# EAGLE schematic main (EAGLE 6.5.0)
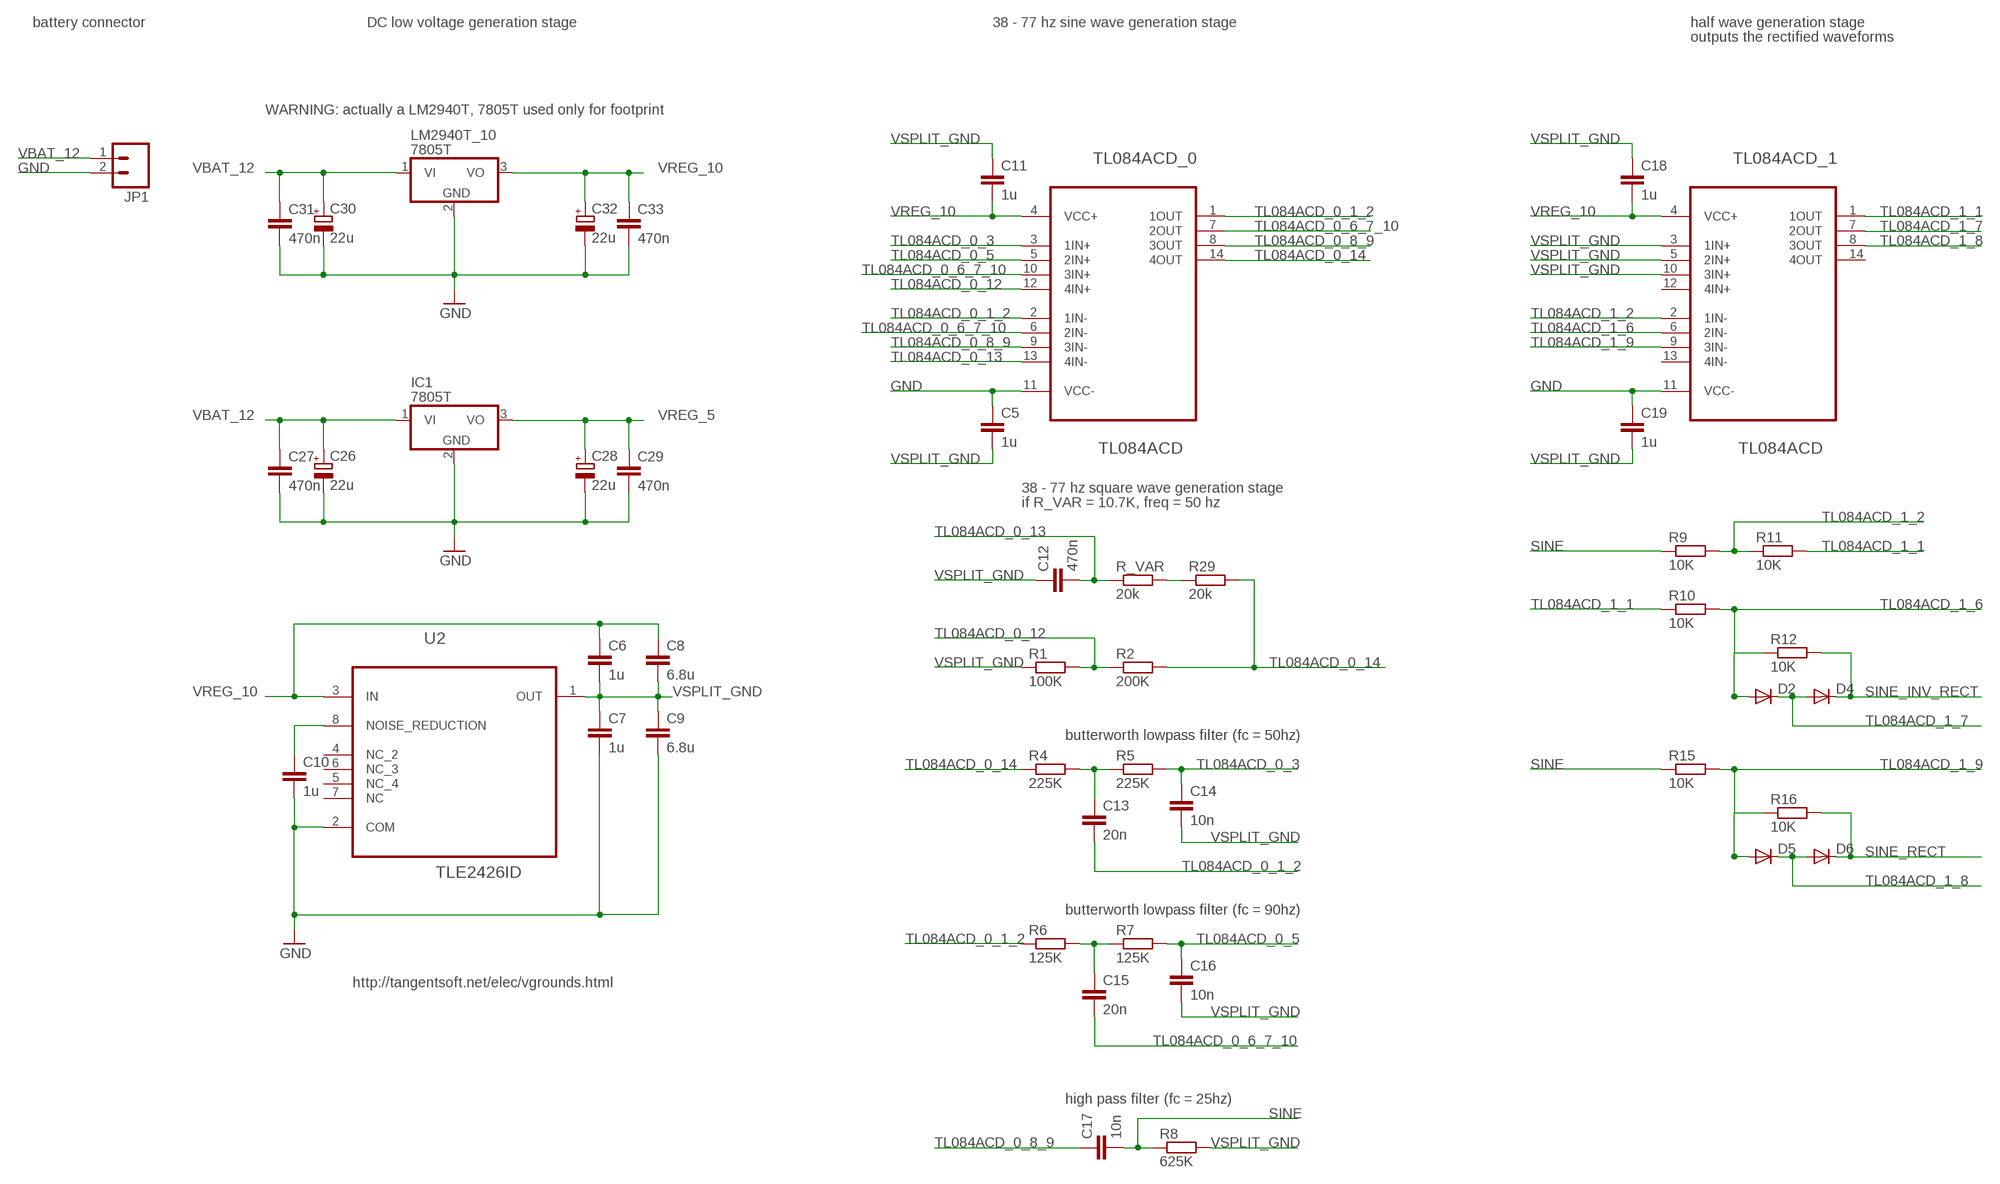
[diagram p0: schematic, sheet 1, part 1 of 2]
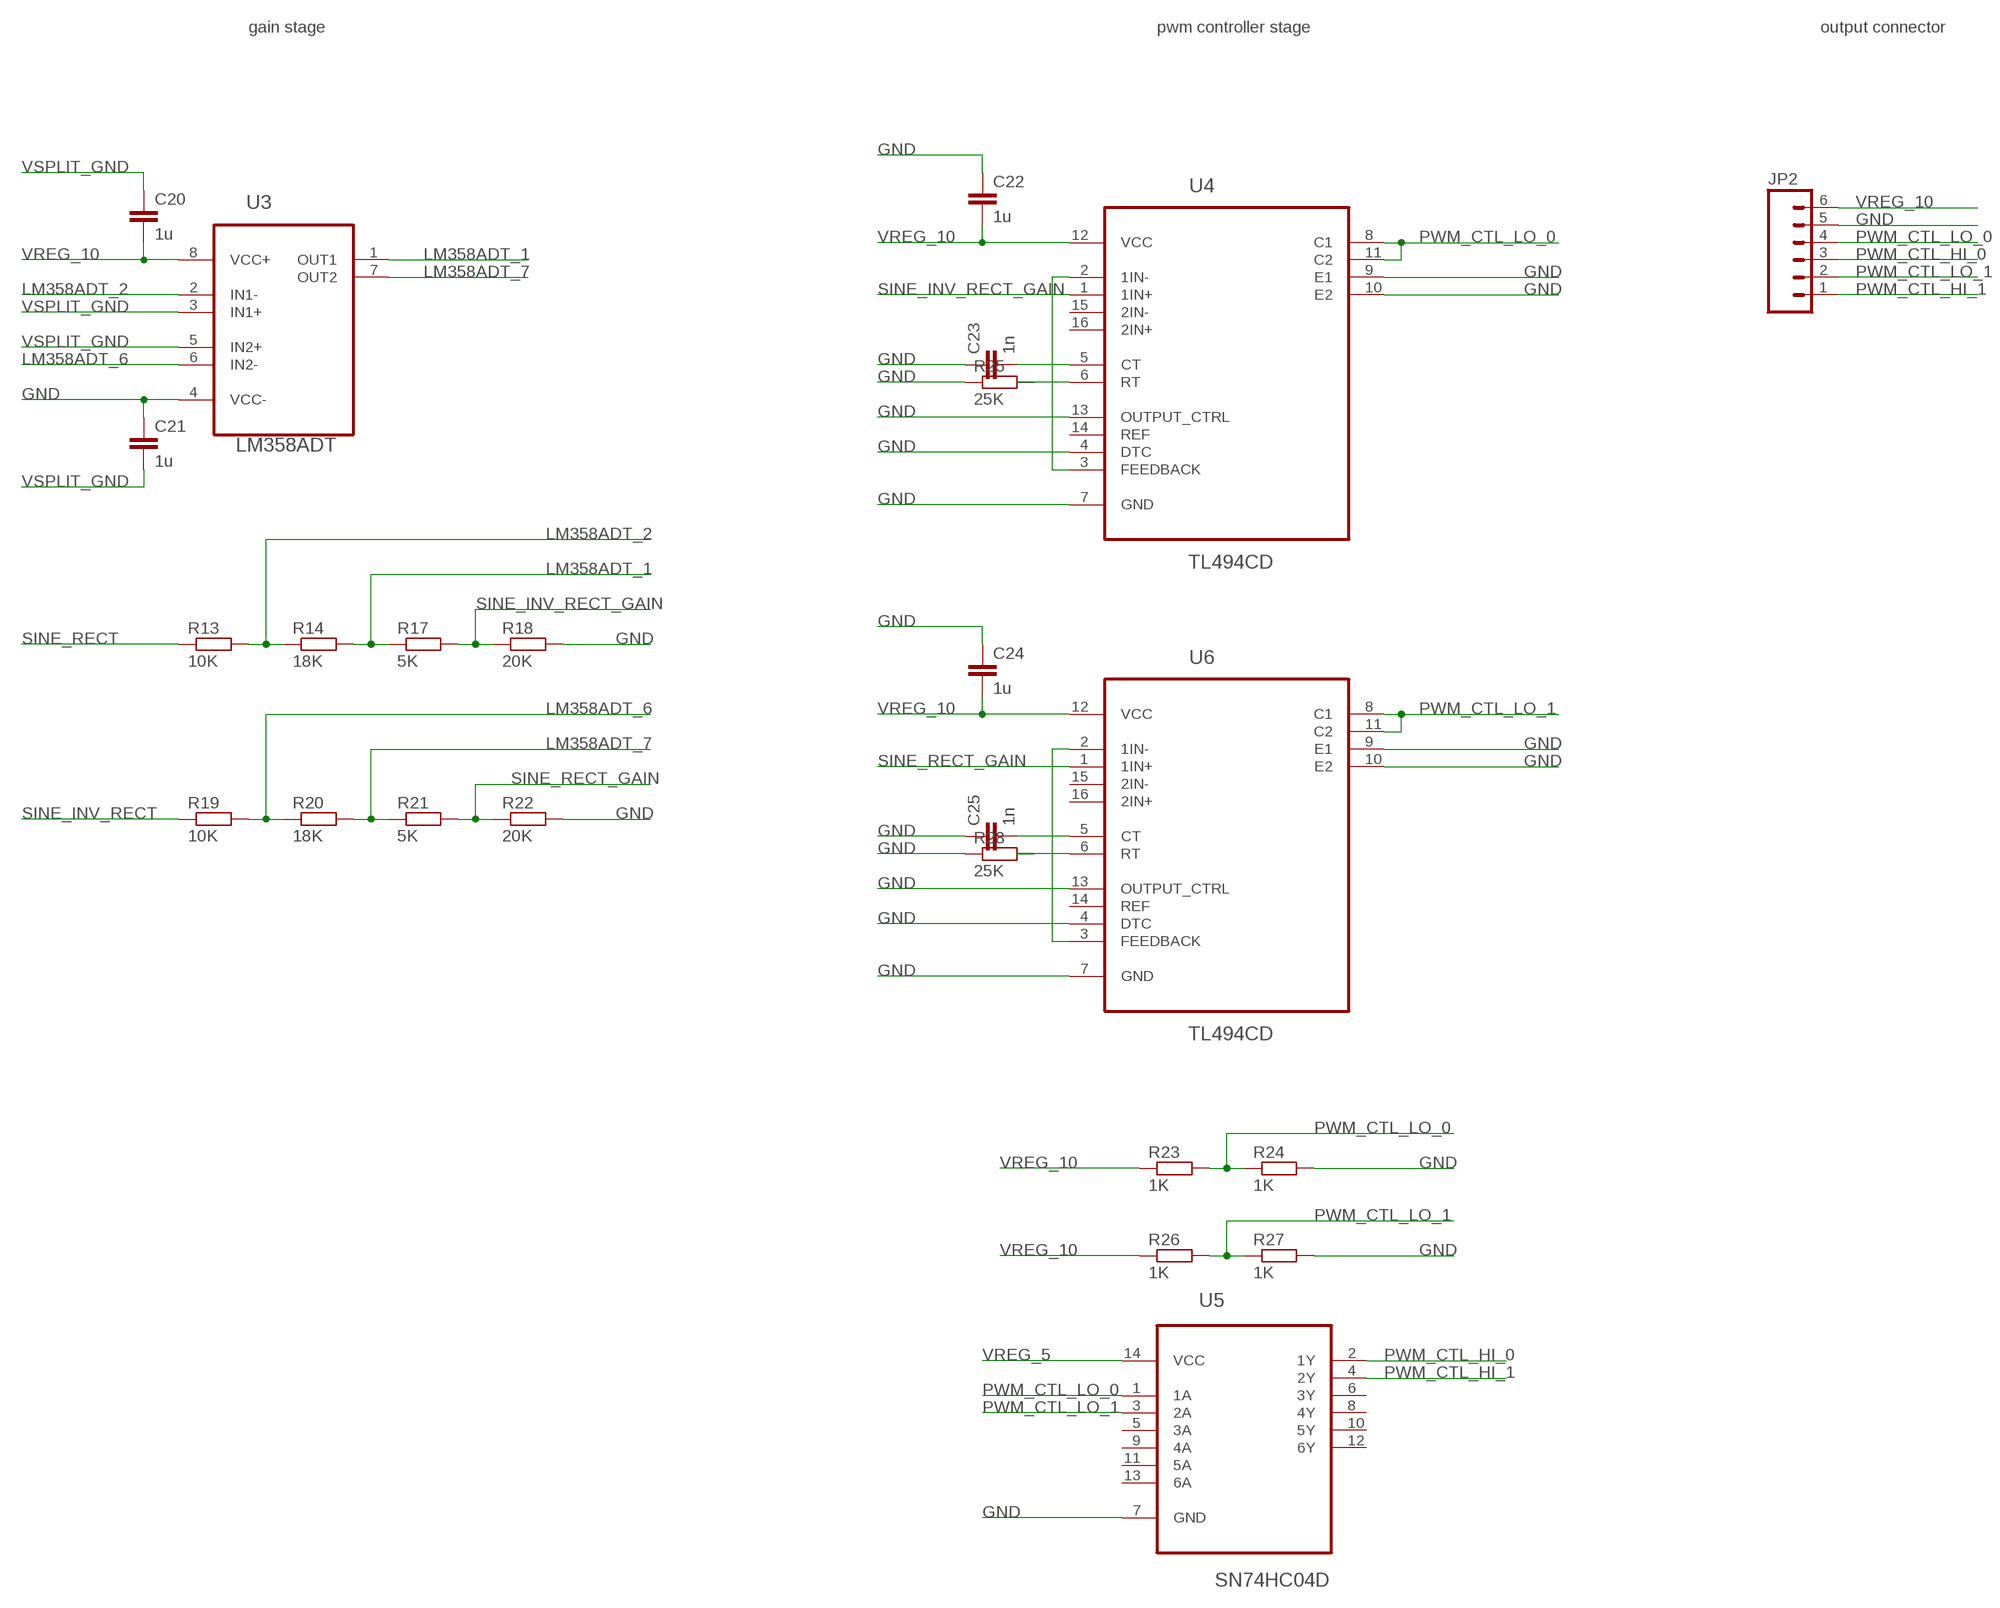
[diagram p1: schematic, sheet 1, part 2 of 2]

## Parts
C5  1u  C-EUC1206  [C1206]
C6  1u  C-EUC1206  [C1206]
C7  1u  C-EUC1206  [C1206]
C8  6.8u  C-EUC1206  [C1206]
C9  6.8u  C-EUC1206  [C1206]
C10  1u  C-EUC1206  [C1206]
C11  1u  C-EUC1206  [C1206]
C12  470n  C-EUC1206  [C1206]
C13  20n  C-EUC1206  [C1206]
C14  10n  C-EUC1206  [C1206]
C15  20n  C-EUC1206  [C1206]
C16  10n  C-EUC1206  [C1206]
C17  10n  C-EUC1206  [C1206]
C18  1u  C-EUC1206  [C1206]
C19  1u  C-EUC1206  [C1206]
C20  1u  C-EUC1206  [C1206]
C21  1u  C-EUC1206  [C1206]
C22  1u  C-EUC1206  [C1206]
C23  1n  C-EUC1206  [C1206]
C24  1u  C-EUC1206  [C1206]
C25  1n  C-EUC1206  [C1206]
C26  22u  CPOL-EU085CS-1AR  [085CS_1AR]
C27  470n  C-EUC1206  [C1206]
C28  22u  CPOL-EU085CS-1AR  [085CS_1AR]
C29  470n  C-EUC1206  [C1206]
C30  22u  CPOL-EU085CS-1AR  [085CS_1AR]
C31  470n  C-EUC1206  [C1206]
C32  22u  CPOL-EU085CS-1AR  [085CS_1AR]
C33  470n  C-EUC1206  [C1206]
D2  DIODE-SOD323-W  [SOD323-W]
D4  DIODE-SOD323-W  [SOD323-W]
D5  DIODE-SOD323-W  [SOD323-W]
D6  DIODE-SOD323-W  [SOD323-W]
IC1  7805T  [TO220H]
JP1  M02LOCK  [1X02_LOCK]
JP2  M06LOCK  [1X06_LOCK]
LM2940T_10  7805T  [TO220H]
R1  100K  R-EU_M1206  [M1206]
R2  200K  R-EU_M1206  [M1206]
R4  225K  R-EU_M1206  [M1206]
R5  225K  R-EU_M1206  [M1206]
R6  125K  R-EU_M1206  [M1206]
R7  125K  R-EU_M1206  [M1206]
R8  625K  R-EU_M1206  [M1206]
R9  10K  R-EU_M1206  [M1206]
R10  10K  R-EU_M1206  [M1206]
R11  10K  R-EU_M1206  [M1206]
R12  10K  R-EU_M1206  [M1206]
R13  10K  R-EU_M1206  [M1206]
R14  18K  R-EU_M1206  [M1206]
R15  10K  R-EU_M1206  [M1206]
R16  10K  R-EU_M1206  [M1206]
R17  5K  R-EU_M1206  [M1206]
R18  20K  R-EU_M1206  [M1206]
R19  10K  R-EU_M1206  [M1206]
R20  18K  R-EU_M1206  [M1206]
R21  5K  R-EU_M1206  [M1206]
R22  20K  R-EU_M1206  [M1206]
R23  1K  R-EU_M1206  [M1206]
R24  1K  R-EU_M1206  [M1206]
R25  25K  R-EU_M1206  [M1206]
R26  1K  R-EU_M1206  [M1206]
R27  1K  R-EU_M1206  [M1206]
R28  25K  R-EU_M1206  [M1206]
R29  20k  R-EU_M1206  [M1206]
R_VAR  20k  R-EU_M1206  [M1206]
TL084ACD_0  TL084ACD  [SOIC127P600X175-14N]
TL084ACD_1  TL084ACD  [SOIC127P600X175-14N]
U2  TLE2426ID  [SOIC127P600X175-8N]
U3  LM358ADT  [SOIC127P600X175-8N]
U4  TL494CD  [SOIC127P600X175-16N]
U5  SN74HC04D  [SOIC127P600X175-14N]
U6  TL494CD  [SOIC127P600X175-16N]

## Nets
GND: C5.1 C7.2 C9.2 C10.2 C19.1 C21.1 C22.1 C23.1 C24.1 C25.1 C26.- C27.2 C28.- C29.2 C30.- C31.2 C32.- C33.2 IC1.2(GND) JP1.2 JP2.5 LM2940T_10.2(GND) R18.2 R22.2 R24.2 R25.1 R27.2 R28.1 TL084ACD_0.11(VCC-) TL084ACD_1.11(VCC-) U2.2(COM) U3.4(VCC-) U4.4(DTC) U4.7(GND) U4.9(E1) U4.10(E2) U4.13(OUTPUT_CTRL) U5.7(GND) U6.4(DTC) U6.7(GND) U6.9(E1) U6.10(E2) U6.13(OUTPUT_CTRL)
LM358ADT_1: R14.2 R17.1 U3.1(OUT1)
LM358ADT_2: R13.2 R14.1 U3.2(IN1-)
LM358ADT_6: R19.2 R20.1 U3.6(IN2-)
LM358ADT_7: R20.2 R21.1 U3.7(OUT2)
N$1: C13.1 R4.2 R5.1
N$2: C10.1 U2.8(NOISE_REDUCTION)
N$3: C15.1 R6.2 R7.1
N$4: U4.2(1IN-) U4.3(FEEDBACK)
N$5: C23.2 U4.5(CT)
N$6: R25.2 U4.6(RT)
N$7: U6.2(1IN-) U6.3(FEEDBACK)
N$8: C25.2 U6.5(CT)
N$9: R28.2 U6.6(RT)
N$10: R29.1 R_VAR.2
PWM_CTL_HI_0: JP2.3 U5.2(1Y)
PWM_CTL_HI_1: JP2.1 U5.4(2Y)
PWM_CTL_LO_0: JP2.4 R23.2 R24.1 U4.8(C1) U4.11(C2) U5.1(1A)
PWM_CTL_LO_1: JP2.2 R26.2 R27.1 U5.3(2A) U6.8(C1) U6.11(C2)
SINE: C17.2 R8.1 R9.1 R15.1
SINE_INV_RECT: D4.C R12.2 R19.1
SINE_INV_RECT_GAIN: R17.2 R18.1 U4.1(1IN+)
SINE_RECT: D6.C R13.1 R16.2
SINE_RECT_GAIN: R21.2 R22.1 U6.1(1IN+)
TL084ACD_0_1_2: C13.2 R6.1 TL084ACD_0.1(1OUT) TL084ACD_0.2(1IN-)
TL084ACD_0_3: C14.1 R5.2 TL084ACD_0.3(1IN+)
TL084ACD_0_5: C16.1 R7.2 TL084ACD_0.5(2IN+)
TL084ACD_0_6_7_10: C15.2 TL084ACD_0.6(2IN-) TL084ACD_0.7(2OUT) TL084ACD_0.10(3IN+)
TL084ACD_0_8_9: C17.1 TL084ACD_0.8(3OUT) TL084ACD_0.9(3IN-)
TL084ACD_0_12: R1.2 R2.1 TL084ACD_0.12(4IN+)
TL084ACD_0_13: C12.2 R_VAR.1 TL084ACD_0.13(4IN-)
TL084ACD_0_14: R2.2 R4.1 R29.2 TL084ACD_0.14(4OUT)
TL084ACD_1_1: R10.1 R11.2 TL084ACD_1.1(1OUT)
TL084ACD_1_2: R9.2 R11.1 TL084ACD_1.2(1IN-)
TL084ACD_1_6: D2.A R10.2 R12.1 TL084ACD_1.6(2IN-)
TL084ACD_1_7: D2.C D4.A TL084ACD_1.7(2OUT)
TL084ACD_1_8: D5.C D6.A TL084ACD_1.8(3OUT)
TL084ACD_1_9: D5.A R15.2 R16.1 TL084ACD_1.9(3IN-)
VBAT_12: C26.+ C27.1 C30.+ C31.1 IC1.1(VI) JP1.1 LM2940T_10.1(VI)
VREG_5: C28.+ C29.1 IC1.3(VO) U5.14(VCC)
VREG_10: C6.1 C8.1 C11.2 C18.2 C20.2 C22.2 C24.2 C32.+ C33.1 JP2.6 LM2940T_10.3(VO) R23.1 R26.1 TL084ACD_0.4(VCC+) TL084ACD_1.4(VCC+) U2.3(IN) U3.8(VCC+) U4.12(VCC) U6.12(VCC)
VSPLIT_GND: C5.2 C6.2 C7.1 C8.2 C9.1 C11.1 C12.1 C14.2 C16.2 C18.1 C19.2 C20.1 C21.2 R1.1 R8.2 TL084ACD_1.3(1IN+) TL084ACD_1.5(2IN+) TL084ACD_1.10(3IN+) U2.1(OUT) U3.3(IN1+) U3.5(IN2+)
Unconnected: TL084ACD_1.12(4IN+) TL084ACD_1.13(4IN-) TL084ACD_1.14(4OUT) U2.4(NC_2) U2.5(NC_4) U2.6(NC_3) U2.7(NC) U4.14(REF) U4.15(2IN-) U4.16(2IN+) U5.5(3A) U5.6(3Y) U5.8(4Y) U5.9(4A) U5.10(5Y) U5.11(5A) U5.12(6Y) U5.13(6A) U6.14(REF) U6.15(2IN-) U6.16(2IN+)

## Notes on the sheet
- battery connector | DC low voltage generation stage | 38 - 77 hz sine wave generation stage | half wave generation stage | gain stage | pwm controller stage | output connector
- outputs the rectified waveforms
- WARNING: actually a LM2940T, 7805T used only for footprint
- 38 - 77 hz square wave generation stage
- if R_VAR = 10.7K, freq = 50 hz
- butterworth lowpass filter (fc = 50hz)
- butterworth lowpass filter (fc = 90hz)
- http://tangentsoft.net/elec/vgrounds.html
- high pass filter (fc = 25hz)

## Library data of the parts
C5-C25 C27 C29 C31 C33 = rcl:C-EU: CAPACITOR, European symbol
C26 C28 C30 C32 = rcl:CPOL-EU: POLARIZED CAPACITOR, European symbol
D2 D4-D6 = diode:DIODE-: DIODE
IC1 LM2940T_10 = linear:78*: Positive VOLTAGE REGULATOR Source: http://cache.national.com/ds/LM/LM78L05.pdf http://www.fairchildsemi.com/ds/LM/LM7805.pdf
JP1 = SparkFun:M02: Header 2 Standard 2-pin 0.1" header. Use with straight break away headers (SKU : PRT-00116), right angle break away headers (PRT-00553), swiss pins (PRT-00743), machine pins (PRT-00117), and female headers (PRT-00115). Molex polarized connector foot print use with SKU : PRT-08233 with associated crimp pins and housings.
JP2 = SparkFun:M06: Header 6 Standard 6-pin 0.1" header. Use with straight break away headers (SKU : PRT-00116), right angle break away headers (PRT-00553), swiss pins (PRT-00743), machine pins (PRT-00117), and female headers (PRT-00115). Molex polarized connector foot print use with SKU : PRT-08094 with associated crimp pins and housings. NOTES ON THE VARIANTS LOCK and LOCK_LONGPADS... This footprint was designed to help hold the alignment of a through-hole component (i.e. 6-pin header) while soldering it into place. You may notice that each hole has been shifted either up or down by 0.005 of an inch from it's more standard position (which is a perfectly straight line). This slight alteration caused the pins (the squares in the middle) to touch the edges of the holes. Because they are alternating, it causes a "brace" to hold the component in place. 0.005 has proven to be the perfect amount of "off-center" position when using our standard breakaway headers. Although looks a little odd when you look at the bare footprint, once you have a header in there, the alteration is very hard to notice. Also, if you push a header all the way into place, it is covered up entirely on the bottom side. This idea of altering the position of holes to aid alignment will be further integrated into the Sparkfun Library for other footprints. It can help hold any component with 3 or more connection pins.
R1 R2 R4-R29 R_VAR = resistor:R-EU_: RESISTOR, European symbol
TL084ACD_0 TL084ACD_1 = tl084acd:TL084ACD: JFET input OPAMPS; MPN: TL084ACD; OC_FARNELL: 9593420; OC_NEWARK: 08F9355; PACKAGE: SOIC-14; SUPPLIER: Texas Instruments
U2 = tle2426id:TLE2426ID: PRECISION VIRTUAL GROUND; MPN: TLE2426ID; OC_FARNELL: 8454833; OC_NEWARK: 35K1234; PACKAGE: SOIC-8; SUPPLIER: Texas Instruments
U3 = lm358ad:LM358ADT: Low-power dual operational amplifiers,SO-8; MPN: LM358ADT; OC_FARNELL: 2253407; OC_NEWARK: 89K0706; PACKAGE: SO-8; SUPPLIER: STMICROELECTRONICS
U4 U6 = tl494cd:TL494CD: PULSE-WIDTH-MODULATION CONTROL CIRCUITS; MPN: TL494CD; OC_FARNELL: 1470531; OC_NEWARK: 67K2881; PACKAGE: SOIC-16; SUPPLIER: TEXAS INSTRUMENTS
U5 = sn74hc04d:SN74HC04D: HEX INVERTERS; MPN: SN74HC04D; OC_FARNELL: 9590943; OC_NEWARK: 72K9430; PACKAGE: SOIC-14; SUPPLIER: Texas Instruments